# EAGLE schematic Pro Trinket Keyboard V3.3 (EAGLE 7.3.0)
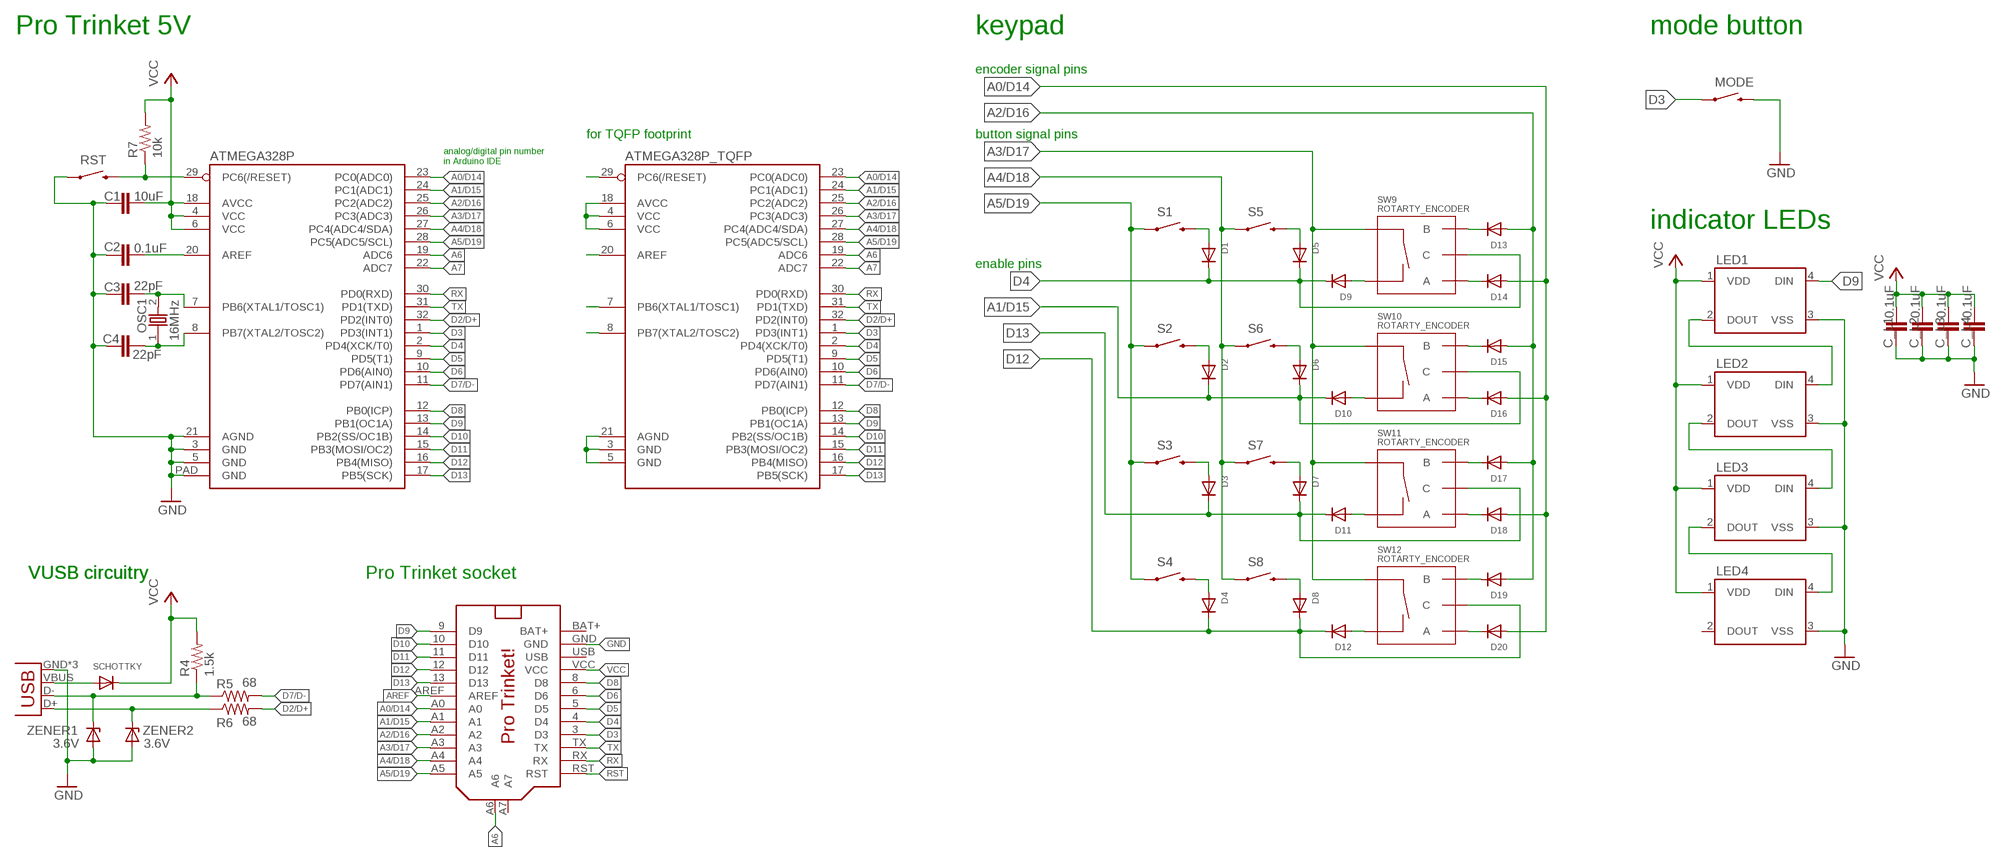
[diagram p0: schematic, sheet 1]

## Parts
ATMEGA328P  ATMEGA328P_MLFMLF32  [MLF32-PAD]
ATMEGA328P_TQFP  ATMEGA328P_TQFP  [TQFP32-08]
C1  10uF  10UF-6.3V-20%(0603)  [0603-CAP]
C2  0.1uF  22PF-50V-5%(0603)  [0603-CAP]
C3  22pF  22PF-50V-5%(0603)  [0603-CAP]
C4  22pF  22PF-50V-5%(0603)  [0603-CAP]
C_L1  0.1uF  22PF-50V-5%(0603)  [0603-CAP]
C_L2  0.1uF  22PF-50V-5%(0603)  [0603-CAP]
C_L3  0.1uF  22PF-50V-5%(0603)  [0603-CAP]
C_L4  0.1uF  22PF-50V-5%(0603)  [0603-CAP]
D1  DIODESOD-123  [SOD-123]
D2  DIODESOD-123  [SOD-123]
D3  DIODESOD-123  [SOD-123]
D4  DIODESOD-123  [SOD-123]
D5  DIODESOD-123  [SOD-123]
D6  DIODESOD-123  [SOD-123]
D7  DIODESOD-123  [SOD-123]
D8  DIODESOD-123  [SOD-123]
D9  DIODESOD-123  [SOD-123]
D10  DIODESOD-123  [SOD-123]
D11  DIODESOD-123  [SOD-123]
D12  DIODESOD-123  [SOD-123]
D13  DIODESOD-123  [SOD-123]
D14  DIODESOD-123  [SOD-123]
D15  DIODESOD-123  [SOD-123]
D16  DIODESOD-123  [SOD-123]
D17  DIODESOD-123  [SOD-123]
D18  DIODESOD-123  [SOD-123]
D19  DIODESOD-123  [SOD-123]
D20  DIODESOD-123  [SOD-123]
JP1  USB-MICROB  [USB-MICROB]
LED1  WS2812B  [WS2812B]
LED2  WS2812B  [WS2812B]
LED3  WS2812B  [WS2812B]
LED4  WS2812B  [WS2812B]
MODE  SWITCH-MOMENTARY-2SIDE_EZ  [TACTILE-PTH-SIDEEZ]
OSC1  16MHz  OSC-XTAL-HC-49U-SMD  [HC-49U]
R4  1.5k  RESISTOR0805-RES  [0805]
R5  68  RESISTOR0805-RES  [0805]
R6  68  RESISTOR0805-RES  [0805]
R7  10k  RESISTOR0805-RES  [0805]
RST  SWITCH-MOMENTARY-2SIDE_EZ  [TACTILE-PTH-SIDEEZ]
S1  SWITCH-MOMENTARY-212MM  [TACTILE-PTH-12MM]
S2  SWITCH-MOMENTARY-212MM  [TACTILE-PTH-12MM]
S3  SWITCH-MOMENTARY-212MM  [TACTILE-PTH-12MM]
S4  SWITCH-MOMENTARY-212MM  [TACTILE-PTH-12MM]
S5  SWITCH-MOMENTARY-212MM  [TACTILE-PTH-12MM]
S6  SWITCH-MOMENTARY-212MM  [TACTILE-PTH-12MM]
S7  SWITCH-MOMENTARY-212MM  [TACTILE-PTH-12MM]
S8  SWITCH-MOMENTARY-212MM  [TACTILE-PTH-12MM]
SCHOTTKY  DIODESMA  [SMADIODE]
SW9  ROTARTY_ENCODER  [ROTARY_ENC_PLAIN]
SW10  ROTARTY_ENCODER  [ROTARY_ENC_PLAIN]
SW11  ROTARTY_ENCODER  [ROTARY_ENC_PLAIN]
SW12  ROTARTY_ENCODER  [ROTARY_ENC_PLAIN]
U$2  PRO_TRINKET  [PROTRINKET]
ZENER1  3.6V  ZENER-DIODESOD80C  [SOD80C]
ZENER2  3.6V  ZENER-DIODESOD80C  [SOD80C]

## Nets
A0/D14: ATMEGA328P.23(PC0(ADC0)) ATMEGA328P_TQFP.23(PC0(ADC0)) D14.A D16.A D18.A D20.A U$2.A0
A1/D15: ATMEGA328P.24(PC1(ADC1)) ATMEGA328P_TQFP.24(PC1(ADC1)) D2.C D6.C D10.C SW10.C U$2.A1
A2/D16: ATMEGA328P.25(PC2(ADC2)) ATMEGA328P_TQFP.25(PC2(ADC2)) D13.A D15.A D17.A D19.A U$2.A2
A3/D17: ATMEGA328P.26(PC3(ADC3)) ATMEGA328P_TQFP.26(PC3(ADC3)) SW9.SW+ SW10.SW+ SW11.SW+ SW12.SW+ U$2.A3
A4/D18: ATMEGA328P.27(PC4(ADC4/SDA)) ATMEGA328P_TQFP.27(PC4(ADC4/SDA)) S5.1 S5.2 S6.1 S6.2 S7.1 S7.2 S8.1 S8.2 U$2.A4
A5/D19: ATMEGA328P.28(PC5(ADC5/SCL)) ATMEGA328P_TQFP.28(PC5(ADC5/SCL)) S1.1 S1.2 S2.1 S2.2 S3.1 S3.2 S4.1 S4.2 U$2.A5
A6: ATMEGA328P.19(ADC6) ATMEGA328P_TQFP.19(ADC6) U$2.A6
A7: ATMEGA328P.22(ADC7) ATMEGA328P_TQFP.22(ADC7)
AREF: ATMEGA328P.20(AREF) ATMEGA328P_TQFP.20(AREF) C2.2 U$2.AREF
D2/D+: ATMEGA328P.32(PD2(INT0)) ATMEGA328P_TQFP.32(PD2(INT0)) R6.2
D3: ATMEGA328P.1(PD3(INT1)) ATMEGA328P_TQFP.1(PD3(INT1)) MODE.1 U$2.3(D3)
D4: ATMEGA328P.2(PD4(XCK/T0)) ATMEGA328P_TQFP.2(PD4(XCK/T0)) D1.C D5.C D9.C SW9.C U$2.4(D4)
D5: ATMEGA328P.9(PD5(T1)) ATMEGA328P_TQFP.9(PD5(T1)) U$2.5(D5)
D6: ATMEGA328P.10(PD6(AIN0)) ATMEGA328P_TQFP.10(PD6(AIN0)) U$2.6(D6)
D7/D-: ATMEGA328P.11(PD7(AIN1)) ATMEGA328P_TQFP.11(PD7(AIN1)) R5.2
D8: ATMEGA328P.12(PB0(ICP)) ATMEGA328P_TQFP.12(PB0(ICP)) U$2.8(D8)
D9: ATMEGA328P.13(PB1(OC1A)) ATMEGA328P_TQFP.13(PB1(OC1A)) LED1.4(DIN) U$2.9(D9)
D10: ATMEGA328P.14(PB2(SS/OC1B)) ATMEGA328P_TQFP.14(PB2(SS/OC1B)) U$2.10(D10)
D11: ATMEGA328P.15(PB3(MOSI/OC2)) ATMEGA328P_TQFP.15(PB3(MOSI/OC2)) U$2.11(D11)
D12: ATMEGA328P.16(PB4(MISO)) ATMEGA328P_TQFP.16(PB4(MISO)) D4.C D8.C D12.C SW12.C U$2.12(D12)
D13: ATMEGA328P.17(PB5(SCK)) ATMEGA328P_TQFP.17(PB5(SCK)) D3.C D7.C D11.C SW11.C U$2.13(D13)
GND: ATMEGA328P.3(GND) ATMEGA328P.5(GND) ATMEGA328P.21(AGND) ATMEGA328P.PAD(GND) ATMEGA328P_TQFP.3(GND) ATMEGA328P_TQFP.5(GND) ATMEGA328P_TQFP.21(AGND) C1.1 C2.1 C3.1 C4.2 C_L1.1 C_L2.1 C_L3.1 C_L4.1 JP1.GND JP1.MT1(GND) JP1.MT2(GND) LED1.3(VSS) LED2.3(VSS) LED3.3(VSS) LED4.3(VSS) MODE.2 RST.1 U$2.GND ZENER1.A ZENER2.A
N$1: LED1.2(DOUT) LED2.4(DIN)
N$2: LED2.2(DOUT) LED3.4(DIN)
N$3: LED3.2(DOUT) LED4.4(DIN)
N$10: JP1.VBUS SCHOTTKY.A
N$11: JP1.D- R4.1 R5.1 ZENER1.C
N$12: JP1.D+ R6.1 ZENER2.C
N$16: D1.A S1.3 S1.4
N$26: D2.A S2.3 S2.4
N$27: D5.A S5.3 S5.4
N$28: D6.A S6.3 S6.4
N$29: D7.A S7.3 S7.4
N$30: D3.A S3.3 S3.4
N$31: D4.A S4.3 S4.4
N$32: D8.A S8.3 S8.4
N$34: D10.A SW10.SW-
N$35: D9.A SW9.SW-
N$36: D11.A SW11.SW-
N$37: D20.C SW12.A
N$38: D19.C SW12.B
N$39: D18.C SW11.A
N$40: D12.A SW12.SW-
N$41: D16.C SW10.A
N$42: D15.C SW10.B
N$43: D14.C SW9.A
N$44: D13.C SW9.B
N$45: D17.C SW11.B
RST: ATMEGA328P.29(PC6(/RESET)) ATMEGA328P_TQFP.29(PC6(/RESET)) R7.1 RST.2 U$2.RST
RX: ATMEGA328P.30(PD0(RXD)) ATMEGA328P_TQFP.30(PD0(RXD)) U$2.RX
TX: ATMEGA328P.31(PD1(TXD)) ATMEGA328P_TQFP.31(PD1(TXD)) U$2.TX
VCC: ATMEGA328P.4(VCC) ATMEGA328P.6(VCC) ATMEGA328P.18(AVCC) ATMEGA328P_TQFP.4(VCC) ATMEGA328P_TQFP.6(VCC) ATMEGA328P_TQFP.18(AVCC) C1.2 C_L1.2 C_L2.2 C_L3.2 C_L4.2 LED1.1(VDD) LED2.1(VDD) LED3.1(VDD) LED4.1(VDD) R4.2 R7.2 SCHOTTKY.C U$2.VCC
XTAL1: ATMEGA328P.7(PB6(XTAL1/TOSC1)) ATMEGA328P_TQFP.7(PB6(XTAL1/TOSC1)) C3.2 OSC1.2
XTAL2: ATMEGA328P.8(PB7(XTAL2/TOSC2)) ATMEGA328P_TQFP.8(PB7(XTAL2/TOSC2)) C4.1 OSC1.1
Unconnected: LED4.2(DOUT) U$2.A7

## Notes on the sheet
- Pro Trinket 5V | keypad | mode button
- encoder signal pins
- for TQFP footprint | button signal pins
- analog/digital pin number
  in Arduino IDE
- indicator LEDs
- enable pins
- VUSB circuitry | VUSB circuitry | Pro Trinket socket

## Power pins joined to a net without a drawn wire
BAT+: U$2.BAT+
USB: U$2.USB

## Library data of the parts
ATMEGA328P = SparkFun-DigitalIC:ATMEGA328P_MLF: 32-Pin Atmega328 part Commonly used on Arduino compatible boards Available in QFP and QFN packages TQFP is IC-09069 QFN is non-stock
ATMEGA328P_TQFP = SparkFun-DigitalIC:ATMEGA328P_TQFP; PROD_ID: IC-09069; VALUE: ATMEGA328P_TQFP
C1 = SparkFun-Capacitors:10UF-6.3V-20%(0603): CAP-11015; PROD_ID: CAP-11015
C2 C_L1-C_L4 = SparkFun-Capacitors:22PF-50V-5%(0603): CAP-07876; PROD_ID: CAP-07876; VALUE: 22pF
C3 C4 = SparkFun-Capacitors:22PF-50V-5%(0603): CAP-07876; PROD_ID: CAP-07876
D1-D20 SCHOTTKY = adafruit:DIODE: Diode SMADIODE - SMA Surface Mount Package 20V 1A Schottky Diode Digikey: 641-1014-6-ND DO-1N4148 - Through Hole Small Current Diode SOD-123 20V 1 A (.5mV Vf) Schottky Diode - Digikey: MBRX120TPMSCT-ND SOD-323 10V 570mA (.38mV Vf, 3ns) Schottky Diode - Digikey: ZLLS410CT-ND SOD-523 30V 30mA Schottky Diode (RB751S-40TE61) - Digikey: RB751S-40TE61CT-ND SOT23-R/W - SOT23 Package (R = Solder Paste/Reflow Ovens, W = Hand-Soldering) BAT54Film 40V 300mA - Digikey: 497-7162-1-ND
JP1 = SparkFun-Connectors:USB: USB Connectors USB-B-PTH is fully proven SKU : PRT-00139/CONN-08278 USB-miniB is fully proven SKU : PRT-00587 USB-A-PCB is untested. USB-A-H is throughly reviewed, but untested. Spark Fun Electronics SKU : PRT-00437 USB-B-SMT is throughly reviewed, but untested. Needs silkscreen touching up. USB-A-S has not been used/tested USB-MB-H has not been used/tested USB-MICROB has been used. CONN-09505; PROD_ID: CONN-09505
LED1-LED4 = SparkFun-LED:WS2812B: WS2812B - Intelligent control LED integrated light source Technical Specifications: Power Supply Voltage (VDD): 3.5 to 5.3 V Input Voltage (VI): -0.5 to VDD+0.5 V Operating Junction Temperature (Topt): -25°C to +80°C Storage Temperature Range (Tstg): -55°C to +150°C
MODE RST = SparkFun-Electromechanical:SWITCH-MOMENTARY-2: Various NO switches- pushbuttons, reed, etc
OSC1 = dp_devices:OSC-XTAL
R4-R7 = SparkFun-Passives:RESISTOR: Resistor Basic schematic elements and footprints for 0603, 1206, and PTH resistors.
S1-S8 = SparkFun-Electromechanical:SWITCH-MOMENTARY-2: Various NO switches- pushbuttons, reed, etc; PROD_ID: SWCH-09185
SW9-SW12 = SparkFun-Electromechanical:ROTARTY_ENCODER: Simple no LED rotary encoder Example: COM-09117
U$2 = adafruit:PRO_TRINKET
ZENER1 ZENER2 = diode:ZENER-DIODE: Z-Diode